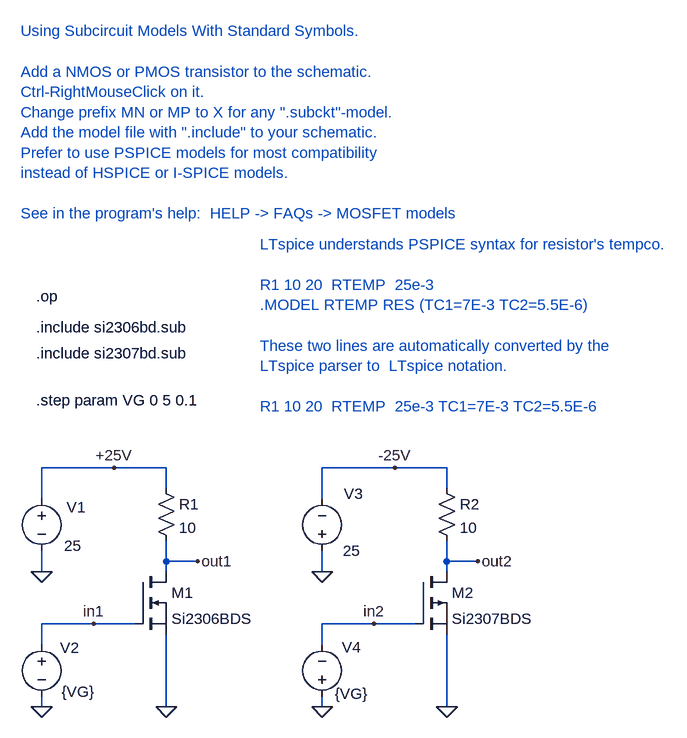
[diagram p0: schematic Si2306_Si2307_test.asc]
Si2306_Si2307_test.asc, the LTspice schematic file:
Version 4
SHEET 1 880 680
WIRE -512 112 -512 64
WIRE -512 224 -512 192
WIRE -512 336 -512 304
WIRE -512 432 -512 416
WIRE -432 304 -512 304
WIRE -400 64 -512 64
WIRE -368 304 -432 304
WIRE -320 64 -400 64
WIRE -320 96 -320 64
WIRE -320 208 -320 176
WIRE -320 224 -320 208
WIRE -320 432 -320 320
WIRE -272 208 -320 208
WIRE -80 112 -80 64
WIRE -80 224 -80 192
WIRE -80 336 -80 304
WIRE -80 432 -80 416
WIRE 0 304 -80 304
WIRE 32 64 -80 64
WIRE 64 304 0 304
WIRE 112 64 32 64
WIRE 112 96 112 64
WIRE 112 208 112 176
WIRE 112 224 112 208
WIRE 112 432 112 320
WIRE 160 208 112 208
FLAG 112 432 0
FLAG -80 432 0
FLAG -80 224 0
FLAG 32 64 -25V
FLAG 0 304 in2
FLAG 160 208 out2
FLAG -320 432 0
FLAG -512 432 0
FLAG -512 224 0
FLAG -400 64 +25V
FLAG -432 304 in1
FLAG -272 208 out1
SYMBOL pmos 64 224 R0
SYMATTR InstName M2
SYMATTR Value Si2307BDS
SYMATTR Prefix X
SYMBOL voltage -80 208 R180
WINDOW 0 -63 104 Left 0
WINDOW 3 -59 16 Left 0
WINDOW 123 0 0 Left 0
WINDOW 39 0 0 Left 0
SYMATTR InstName V3
SYMATTR Value 25
SYMBOL voltage -80 432 R180
WINDOW 0 -60 92 Left 0
WINDOW 3 -20 20 Right 0
WINDOW 123 0 0 Left 0
WINDOW 39 0 0 Left 0
SYMATTR InstName V4
SYMATTR Value {VG}
SYMBOL res 96 80 R0
SYMATTR InstName R2
SYMATTR Value 10
SYMBOL voltage -512 96 R0
WINDOW 0 39 29 Left 0
WINDOW 3 35 88 Left 0
WINDOW 123 0 0 Left 0
WINDOW 39 0 0 Left 0
SYMATTR InstName V1
SYMATTR Value 25
SYMBOL voltage -512 320 R0
WINDOW 0 29 21 Left 0
WINDOW 3 31 89 Left 0
WINDOW 123 0 0 Left 0
WINDOW 39 0 0 Left 0
SYMATTR InstName V2
SYMATTR Value {VG}
SYMBOL res -336 80 R0
SYMATTR InstName R1
SYMATTR Value 10
SYMBOL nmos -368 224 R0
SYMATTR InstName M1
SYMATTR Value Si2306BDS
SYMATTR Prefix X
TEXT -520 -40 Left 0 !.step param VG 0 5 0.1
TEXT -520 -152 Left 0 !.include si2306bd.sub
TEXT -520 -112 Left 0 !.include si2307bd.sub
TEXT -544 -608 Left 0 ;Using Subcircuit Models With Standard Symbols.\n \nAdd a NMOS or PMOS transistor to the schematic.\nCtrl-RightMouseClick on it.\nChange prefix MN or MP to X for any ".subckt"-model.\nAdd the model file with ".include" to your schematic.\nPrefer to use PSPICE models for most compatibility\ninstead of HSPICE or I-SPICE models.\n \nSee in the program's help:  HELP -> FAQs -> MOSFET models
TEXT -176 -280 Left 0 ;LTspice understands PSPICE syntax for resistor's tempco.\n \nR1 10 20  RTEMP  25e-3\n.MODEL RTEMP RES (TC1=7E-3 TC2=5.5E-6)\n \nThese two lines are automatically converted by the \nLTspice parser to  LTspice notation.\n \nR1 10 20  RTEMP  25e-3 TC1=7E-3 TC2=5.5E-6
TEXT -520 -200 Left 0 !.op

The netlist it stands for:
* Si2306_Si2307_test.asc
XM2 out2 in2 0 Si2307BDS  ; pins D G S
V3 0 -25V 25
V4 0 in2 {VG}
R2 -25V out2 10
V1 +25V 0 25
V2 in1 0 {VG}
R1 +25V out1 10
XM1 out1 in1 0 Si2306BDS  ; pins D G S
.step param VG 0 5 0.1
.include si2306bd.sub
.include si2307bd.sub
* Using Subcircuit Models With Standard Symbols.
* Add a NMOS or PMOS transistor to the schematic.
* Ctrl-RightMouseClick on it.
* Change prefix MN or MP to X for any ".subckt"-model.
* Add the model file with ".include" to your schematic.
* Prefer to use PSPICE models for most compatibility
* instead of HSPICE or I-SPICE models.
* See in the program's help:  HELP -> FAQs -> MOSFET models
* LTspice understands PSPICE syntax for resistor's tempco.
* R1 10 20  RTEMP  25e-3
* .MODEL RTEMP RES (TC1=7E-3 TC2=5.5E-6)
* These two lines are automatically converted by the
* LTspice parser to  LTspice notation.
* R1 10 20  RTEMP  25e-3 TC1=7E-3 TC2=5.5E-6
.op
.backanno
.end